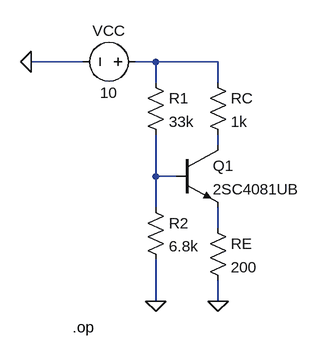
[diagram p0: schematic lab2_task3.asc]
lab2_task3.asc, the LTspice schematic file:
Version 4.1
SHEET 1 880 680
WIRE 16 112 -64 112
WIRE 128 112 96 112
WIRE 224 112 128 112
WIRE 128 144 128 112
WIRE 224 144 224 112
WIRE 224 240 224 224
WIRE 128 288 128 224
WIRE 160 288 128 288
WIRE 128 336 128 288
WIRE 224 368 224 336
WIRE 128 480 128 416
WIRE 224 480 224 448
FLAG -64 112 0
FLAG 224 480 0
FLAG 128 480 0
SYMBOL voltage 112 112 R90
WINDOW 0 -32 56 VBottom 2
WINDOW 3 32 56 VTop 2
SYMATTR InstName VCC
SYMATTR Value 10
SYMBOL npn 160 240 R0
SYMATTR InstName Q1
SYMATTR Value 2SC4081UB
SYMBOL res 208 128 R0
SYMATTR InstName RC
SYMATTR Value 1k
SYMBOL res 208 352 R0
SYMATTR InstName RE
SYMATTR Value 200
SYMBOL res 112 128 R0
SYMATTR InstName R1
SYMATTR Value 33k
SYMBOL res 112 320 R0
SYMATTR InstName R2
SYMATTR Value 6.8k
TEXT 0 520 Left 2 !.op

The netlist it stands for:
* lab2_task3.asc
VCC N001 0 10
Q1 N002 N003 N004 0 2SC4081UB
RC N001 N002 1k
RE N004 0 200
R1 N001 N003 33k
R2 N003 0 6.8k
.model NPN NPN
.model PNP PNP
.lib standard.bjt
.op
.backanno
.end